# EAGLE schematic buck-converter (EAGLE 7.1.0)
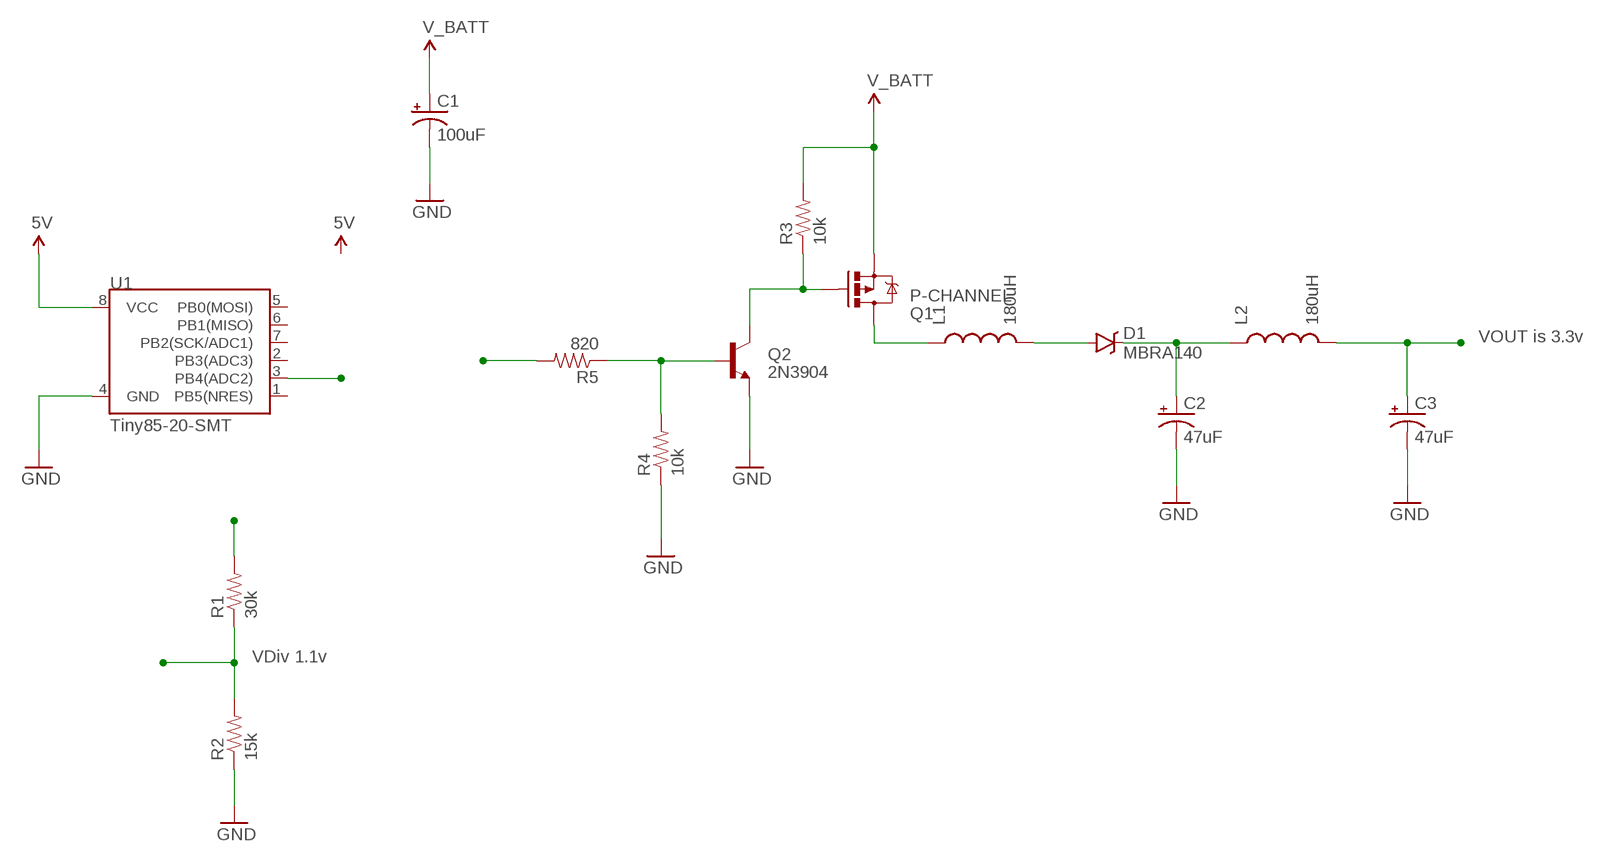
[diagram p0: schematic, sheet 1]

## Parts
C1  100uF  47UF-50V-20%(ELECT)  [PANASONIC_D]
C2  47uF  47UF-50V-20%(ELECT)  [PANASONIC_D]
C3  47uF  47UF-50V-20%(ELECT)  [PANASONIC_D]
D1  MBRA140  DIODE-SCHOTTKY-MBRA140  [SMA-DIODE]
L1  180uH  INDUCTORCR54  [CR54]
L2  180uH  INDUCTORCR54  [CR54]
Q1  P-CHANNEL  MOSFET-PCHANNELSMD  [SOT23-3]
Q2  2N3904  TRANSISTOR_NPNBC547  [TO-92-AMMO]
R1  30k  RESISTOR0603  [0603-RES]
R2  15k  RESISTOR0603  [0603-RES]
R3  10k  RESISTOR0603  [0603-RES]
R4  10k  RESISTOR0603  [0603-RES]
R5  820  RESISTOR0603  [0603-RES]
U1  Tiny85-20-SMT  ATTINY45TINY85-20-SMT  [SO08-EIAJ]

## Nets
5V: U1.8(VCC)
FB: R1.1 R2.2
GND: C1.- C2.- C3.- Q2.3(E) R2.1 R4.1 U1.4(GND)
N$2: Q1.1(G) Q2.1(C) R3.1
N$3: L1.P$1 Q1.3(D)
N$4: D1.A L1.P$2
N$5: C2.+ D1.C L2.P$1
N$8: Q2.2(B) R4.2 R5.1
PWM: R5.2 U1.3(PB4(ADC2))
V_BATT: C1.+ Q1.2(S) R3.2
VOUT: C3.+ L2.P$2 R1.2
Unconnected: U1.1(PB5(NRES)) U1.2(PB3(ADC3)) U1.5(PB0(MOSI)) U1.6(PB1(MISO)) U1.7(PB2(SCK/ADC1))

## Notes on the sheet
- VOUT is 3.3v
- VDiv 1.1v

## Library data of the parts
C1-C3 = SparkFun-Capacitors:47UF-50V-20%(ELECT): CAP-10547; PROD_ID: CAP-10547
D1 = SparkFun-DiscreteSemi:DIODE-SCHOTTKY: Schottky diodes in SFE's production catalog BAT20J 1A 23V 0.62Vf RB751 120mA 40V 0.37Vf PMEG4005EJ 0.5A 40V 0.42Vf MBRA140 1A 40V 0.5Vf B340A 3A 40V SMA; PROD_ID: DIO-08053
L1 L2 = SparkFun-Passives:INDUCTOR: Inductors Basic Inductor/Choke - 0603 and 1206. Footprints are not proven and vary greatly between part numbers. SRN6045- 33uH, 20% 1.4A SDR0403-560KL - 56uH, 10%, 500mA RMS/740mA peak
Q1 = SparkFun-DiscreteSemi:MOSFET-PCHANNEL: Generic PMOSFET IRLML2244 - TRANS-11153 (SOT-23 -20V -4.3A) (1.Gate 2.Source 3.Drain) FQP27P06 - COM-10349 <http://www.sparkfun.com/products/10349> (TO-220 -60V -27A) (1.Gate 2.Source 3.Drain)
Q2 = SparkFun-DiscreteSemi:TRANSISTOR_NPN: Generic NPN BJT MMBT2222A - TRANS-08049 (SOT-23, 1A 40V) MPSA42 - TRANS-09116 (SOT-23, 500mA 300V) MMBT5088LT1G - TRANS-11160 (SOT-23, 50 mA 30V) BC547 - COM-08928 <http://www.sparkfun.com/products/8928> (TO-92 45V 100mA) (1.Collector 2.Base 3.Emitter) 2N3904 - COM-00521 <http://www.sparkfun.com/products/521> (TO-92 40V 200mA) (1.Emitter 2.Base 3.Collector) P2N2222A - COM-12852 <http://www.sparkfun.com/products/12852> (TO-92 40V 600mA) (1.Collector 2.Base 3.Emitter)
R1-R5 = SparkFun-Resistors:RESISTOR: Resistor Basic schematic elements and footprints for 0603, 1206, and PTH resistors.
U1 = SparkFun-DigitalIC:ATTINY45: Atmel 8-pin 2/4/8kB flash uC; PROD_ID: IC-09092